# Altium schematic sheet rsx_low_power_board_24V.SchDoc
size A4
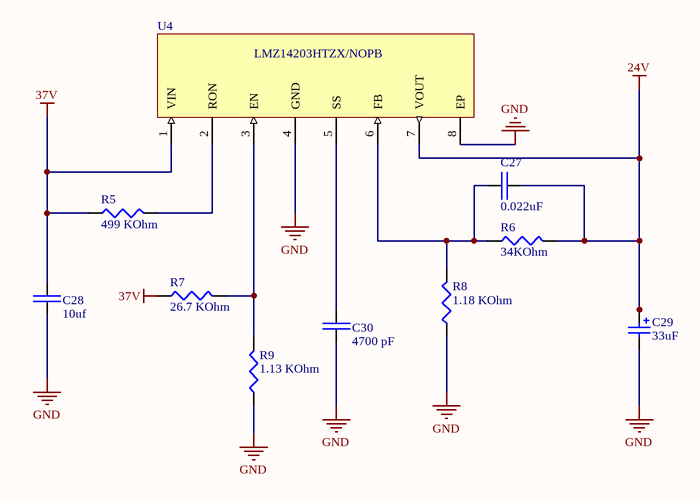
[diagram p0: rsx_low_power_board_24V.SchDoc]

## Parts
C27  0.022uF  [0.022uF Ceramic]
C28  10uf  [10uF capacitor LPB]
C29  33uF  [33uF Through hole Radical]
C30  4700 pF  [4700uF 0805]
R5  499 KOhm  [499KOhm RG2012]
R6  34KOhm  [34 KOhm Resistor ERA-6A]
R7  26.7 KOhm  [34 KOhm Resistor ERA-6A]
R8  1.18 KOhm  [34 KOhm Resistor ERA-6A]
R9  1.13 KOhm  [34 KOhm Resistor ERA-6A]
U4  LMZ14203HTZX/NOPB  [24V DC to DC buck]

## Nets
24V: C27.2 C29.1 R6.2 U4.7(VOUT)
37V: C28.1 R5.1 R7.1 U4.1(VIN)
GND: C28.2 C29.2 C30.1 R8.1 R9.1 U4.4(GND) U4.8(EP)
NetC27_1: C27.1 R6.1 R8.2 U4.6(FB)
NetC30_2: C30.2 U4.5(SS)
NetR5_2: R5.2 U4.2(RON)
NetR7_2: R7.2 R9.2 U4.3(EN)

## Library data of the parts
C27 = 0.022uF C0805C223K5RACTU: KEMET - C0805C223K5RACTU - CAP, MLCC, X7R, 22NF, 50V, 0805; Dielectric Material: Ceramic; Tolerance: 10%; Supplier 1: Digi-Key; Supplier Part Number 1: 399-1163-1-ND; Manufacturer 1: KEMET; Manufacturer Part Number 1: C0805C223K5RACTU; Stock 1: 516153; Pricing 1: 1=0,10000, 10=0,06000, 100=0,02670, 500=0,01906, 1000=0,01497 (USD); RoHS: Yes; Mount: Surface Mount; Case/Package: 0805; Min Operating Temperature: -55°C; Max Operating Temperature: 125°C; Packaging: Tape and Reel; Capacitance: 22nF; Dielectric: X7R; Voltage Rating (DC): 50V; Voltage: 50V; Length: 2mm; Height: 0.78mm; Depth: 1.25mm; Radiation Hardening: No; ComponentLink1URL: https://datasheet.ciiva.com/18193/getdatasheetpartid-385695-18193669.pdf?src-supplier=Verical; ComponentLink1Description: https://datasheet.ciiva.com/18193/getdatasheetpartid-385695-18193669.pdf?src-supplier=Verical
C28 = GRT31CR61H106ME01L: CAP CER 10UF 50V X5R 1206; Manufacturer 1: Murata; Tolerance: 20%; Supplier 1: Digi-Key; Supplier Part Number 1: 490-12457-1-ND; Manufacturer Part Number 1: GRT31CR61H106ME01L; Stock 1: 8159; Pricing 1: 1=0,50000, 10=0,34900, 100=0,20920, 500=0,15690, 1000=0,13249 (USD); RoHS: Yes; Mount: Surface Mount; Case/Package: 1206; Case Code (Metric): 3216; Case Code (Imperial): 1206; Min Operating Temperature: -55°C; Max Operating Temperature: 85°C; Packaging: Tape and Reel; Capacitance: 10uF; Voltage Rating: 50V; Length: 0.126inch; Width: 0.063inch; Thickness: 0.071inch; Ratings: AEC-Q200; ComponentLink1URL: http://search.murata.co.jp/Ceramy/image/img/A01X/G101/ENG/GRT31CR61H106ME01-01.pdf?src-supplier=Digi-Key; ComponentLink1Description: http://search.murata.co.jp/Ceramy/image/img/A01X/G101/ENG/GRT31CR61H106ME01-01.pdf?src-supplier=Digi-Key; Category: Capacitor
C29 = 33uF UFW1H330MDD1TD: CAP ALUM 33UF 20% 50V RADIAL; Manufacturer 1: Nichicon; Ripple Current: 120mA; Life (Hours): 2000Hour; Supplier 1: Digi-Key; Supplier Part Number 1: 493-11010-1-ND; Manufacturer Part Number 1: UFW1H330MDD1TD; Stock 1: 4144; Pricing 1: 1=0,23000, 10=0,16000, 100=0,09070, 500=0,06404, 1000=0,05603 (USD); RoHS: Yes; Mount: Through Hole; Case/Package: Radial; Min Operating Temperature: -40°C; Max Operating Temperature: 85°C; Package Quantity: 1; Packaging: Tape and Reel; Capacitance: 33uF; Tolerance: 20%; Voltage Rating: 50V; Lead Pitch: 0.079inch; Height - Seated (Max): 0.492inch; ComponentLink1URL: http://nichicon-us.com/english/products/pdfs/e-ufw.pdf?src-supplier=Digi-Key; ComponentLink1Description: http://nichicon-us.com/english/products/pdfs/e-ufw.pdf?src-supplier=Digi-Key; ComponentLink2URL: http://nichicon-us.com/english/products/pdfs/e-mi_tape.pdf?src-supplier=Digi-Key; ComponentLink2Description: http://nichicon-us.com/english/products/pdfs/e-mi_tape.pdf?src-supplier=Digi-Key
C30 = 4700pF 0805: KEMET - C0805C472K5RACTU - CERAMIC CAPACITOR 4700PF, 50V, X7R, 10%, 0805; Capacitance: 4.7nF; Supplier 1: Digi-Key; Supplier Part Number 1: 399-1155-1-ND; Manufacturer 1: KEMET; Manufacturer Part Number 1: C0805C472K5RACTU; Stock 1: 374666; Pricing 1: 1=0,10000, 10=0,06800, 100=0,03040, 500=0,02172, 1000=0,01706 (USD); RoHS: Yes; Mount: Surface Mount; Case/Package: 0805; Number of Pins: 2; Weight: 0.000194oz; Dielectric Material: Ceramic; Contact Plating: Tin,Matte; Case Code (Imperial): 0805; Case Code (Metric): 2012; Min Operating Temperature: -55°C; Max Operating Temperature: 125°C; Tolerance: 10%; Packaging: Tape and Reel; Dielectric: X7R; Voltage Rating (DC): 50V; Package Quantity: 1; Voltage Rating: 50V; Termination: SMD/SMT; Voltage: 50V; Length: 2mm; Height: 0.78mm; Depth: 1.25mm; Width: 0.049inch; Thickness: 0.035inch; Radiation Hardening: No; REACH SVHC: No SVHC; ComponentLink1URL: https://datasheet.ciiva.com/6074/kem-c1002-x7r-smd-6074679.pdf?src-supplier=Farnell; ComponentLink1Description: https://datasheet.ciiva.com/6074/kem-c1002-x7r-smd-6074679.pdf?src-supplier=Farnell; ComponentLink2URL: https://datasheet.ciiva.com/28682/1851736-28682318.pdf?src-supplier=Element14; ComponentLink2Description: https://datasheet.ciiva.com/28682/1851736-28682318.pdf?src-supplier=Element14
R5 = RG2012P-4993-B-T5: RES SMD 499K OHM 0.1% 1/8W 0805; Manufacturer 1: Susumu; Resistance: 499kR; Power Rating: 125mW; Voltage Rating: 150V; Temperature Coefficient: 25ppm/°C; Supplier 1: Digi-Key; Supplier Part Number 1: RG20P499KBCT-ND; Manufacturer Part Number 1: RG2012P-4993-B-T5; Stock 1: 27646; Pricing 1: 1=0,41000, 10=0,31800, 100=0,13360, 1000=0,07374, 2500=0,06913 (USD); RoHS: Yes; Case/Package: 0805; Weight: 0.000194oz; Case Code (Imperial): 0805; Case Code (Metric): 2012; Min Operating Temperature: -55°C; Max Operating Temperature: 155°C; Packaging: Tape and Reel; Tolerance: 0.1%; Termination: SMD/SMT; Composition: Thin Film; Voltage Rating (DC): 150V; Length: 2mm; Height: 0.4mm; Width: 1.2mm; Lead Free: Lead Free; ComponentLink1URL: https://datasheet.ciiva.com/5624/rg-rm-rgh-datasheet-5624071.pdf?src-supplier=Mouser; ComponentLink1Description: https://datasheet.ciiva.com/5624/rg-rm-rgh-datasheet-5624071.pdf?src-supplier=Mouser
R6 = ERA6AEB3402V: RES SMD 34K OHM 0.1% 1/8W 0805; Manufacturer 1: Panasonic; Resistance: 34kR; Temperature Coefficient: 25ppm/°C; Max Power Dissipation: 125mW; Voltage Rating: 200V; Voltage Rating (DC): 100V; Supplier 1: Digi-Key; Supplier Part Number 1: P34KDACT-ND; Manufacturer Part Number 1: ERA6AEB3402V; Stock 1: 7057; Pricing 1: 1=0,36000, 10=0,30200, 100=0,11820, 1000=0,04948, 2500=0,04536 (USD); RoHS: Yes; Mount: Surface Mount; Case/Package: 0805; Number of Pins: 2; Case Code (Imperial): 0805; Case Code (Metric): 2012; Contact Plating: Tin; Min Operating Temperature: -55°C; Max Operating Temperature: 155°C; Tolerance: 0.1%; Packaging: Tape and Reel; Composition: Metal Film,Thin Film; Number of Terminations: 2; Features: Automotive AEC-Q200; Power Rating: 125mW; Package Quantity: 5000; Termination: SMD/SMT; Military Standard: Not; Length: 2mm; Height: 0.5mm; Width: 1.25mm; Depth: 1.25mm; Radiation Hardening: No; Lead Free: Lead Free; REACH SVHC: No SVHC; ComponentLink1URL: https://datasheet.ciiva.com/11815/0900766b80eb1d8c-11815791.pdf?src-supplier=RSComponents; ComponentLink1Description: https://datasheet.ciiva.com/11815/0900766b80eb1d8c-11815791.pdf?src-supplier=RSComponents; ComponentLink2URL: https://datasheet.ciiva.com/41450/001181326-da-01-en-widerstand-era-0805-34k0-0-1-5000st-41450489.pdf?src-supplier=Conrad; ComponentLink2Description: https://datasheet.ciiva.com/41450/001181326-da-01-en-widerstand-era-0805-34k0-0-1-5000st-41450489.pdf?src-supplier=Conrad; ComponentLink3URL: https://datasheet.ciiva.com/9190/aoa0000ce26-9190487.pdf?src-supplier=Avnet; ComponentLink3Description: https://datasheet.ciiva.com/9190/aoa0000ce26-9190487.pdf?src-supplier=Avnet; ComponentLink4URL: https://datasheet.ciiva.com/17210/aoa0000ce26-17210191.pdf?src-supplier=Avnet+Europe; ComponentLink4Description: https://datasheet.ciiva.com/17210/aoa0000ce26-17210191.pdf?src-supplier=Avnet+Europe; ComponentLink5URL: https://datasheet.ciiva.com/22705/485442-22705221.pdf?src-supplier=Element14; ComponentLink5Description: https://datasheet.ciiva.com/22705/485442-22705221.pdf?src-supplier=Element14; ComponentLink6URL: https://datasheet.ciiva.com/6052/485442-6052790.pdf?src-supplier=Farnell; ComponentLink6Description: https://datasheet.ciiva.com/6052/485442-6052790.pdf?src-supplier=Farnell; ComponentLink7URL: https://datasheet.ciiva.com/7870/485442-7870667.pdf?src-supplier=Element14; ComponentLink7Description: https://datasheet.ciiva.com/7870/485442-7870667.pdf?src-supplier=Element14; ComponentLink8URL: https://datasheet.ciiva.com/7870/485442-7870668.pdf?src-supplier=Element14; ComponentLink8Description: https://datasheet.ciiva.com/7870/485442-7870668.pdf?src-supplier=Element14
R7-R9 = ERA-6AEB1181V: RES SMD 1.18K OHM 0.1% 1/8W 0805; Manufacturer 1: Panasonic; Resistance: 1.18kR; Power Rating: 125mW; Voltage Rating: 100V; Temperature Coefficient: 25ppm/°C; Supplier 1: Digi-Key; Supplier Part Number 1: P1.18KDACT-ND; Manufacturer Part Number 1: ERA-6AEB1181V; Stock 1: 9011; Pricing 1: 1=0,36000, 10=0,30200, 100=0,11820, 1000=0,04948, 2500=0,04536 (USD); RoHS: Yes; Mount: Surface Mount; Case/Package: 0805; Number of Pins: 2; Case Code (Imperial): 0805; Case Code (Metric): 2012; Contact Plating: Tin; Min Operating Temperature: -55°C; Max Operating Temperature: 155°C; Tolerance: 0.1%; Packaging: Tape and Reel; Composition: Metal Film,Thin Film; Package Quantity: 1; Termination: SMD/SMT; Number of Terminations: 2; Max Power Dissipation: 125mW; Voltage Rating (DC): 100V; Features: Automotive AEC-Q200; Length: 2mm; Height: 0.5mm; Width: 1.25mm; Depth: 1.25mm; Radiation Hardening: No; Lead Free: Lead Free; ComponentLink1URL: https://datasheet.ciiva.com/11811/0900766b80eb1d8c-11811515.pdf?src-supplier=RSComponents; ComponentLink1Description: https://datasheet.ciiva.com/11811/0900766b80eb1d8c-11811515.pdf?src-supplier=RSComponents; ComponentLink2URL: https://datasheet.ciiva.com/26335/459360-da-01-en-widerstand-0805-era-26335818.pdf?src-supplier=Conrad; ComponentLink2Description: https://datasheet.ciiva.com/26335/459360-da-01-en-widerstand-0805-era-26335818.pdf?src-supplier=Conrad; ComponentLink3URL: https://datasheet.ciiva.com/7911/485442-7911589.pdf?src-supplier=Element14; ComponentLink3Description: https://datasheet.ciiva.com/7911/485442-7911589.pdf?src-supplier=Element14; ComponentLink4URL: https://datasheet.ciiva.com/7911/485442-7911590.pdf?src-supplier=Element14; ComponentLink4Description: https://datasheet.ciiva.com/7911/485442-7911590.pdf?src-supplier=Element14; ComponentLink5URL: https://datasheet.ciiva.com/5870/485442-5870600.pdf?src-supplier=Farnell; ComponentLink5Description: https://datasheet.ciiva.com/5870/485442-5870600.pdf?src-supplier=Farnell; ComponentLink6URL: https://datasheet.ciiva.com/5870/485442-5870601.pdf?src-supplier=Farnell; ComponentLink6Description: https://datasheet.ciiva.com/5870/485442-5870601.pdf?src-supplier=Farnell; ComponentLink7URL: https://datasheet.ciiva.com/9198/aoa0000ce26-9198586.pdf?src-supplier=Avnet; ComponentLink7Description: https://datasheet.ciiva.com/9198/aoa0000ce26-9198586.pdf?src-supplier=Avnet; ComponentLink8URL: https://datasheet.ciiva.com/5870/485442-5870603.pdf?src-supplier=Farnell; ComponentLink8Description: https://datasheet.ciiva.com/5870/485442-5870603.pdf?src-supplier=Farnell
U4 = LMZ14203HTZX/NOPB: IC BUCK SYNC ADJ 3A TO-PMOD-7; Manufacturer 1: TI National Semiconductor; Number of Outputs: 1; Output Voltage: 5V; Max Input Voltage: 42V; Min Input Voltage: 6V; Efficiency: 97%; Voltage - Output 1: 30V; Isolation: Non-Isolated; Max Power Dissipation: 90W; Switching Frequency: 1MHz; Supplier 1: Digi-Key; Supplier Part Number 1: 296-43602-1-ND; Manufacturer Part Number 1: LMZ14203HTZX/NOPB; Stock 1: 794; Pricing 1: 1=12,71000, 5=12,61600, 10=12,52000, 25=12,32720, 50=11,94180, 100=10,78620, 250=10,59356 (USD); RoHS: Yes; Mount: Surface Mount; Number of Pins: 7; Contact Plating: Tin,Matte; Min Operating Temperature: -40°C; Max Operating Temperature: 125°C; Output Current: 3A; Packaging: Tape and Reel; Package Quantity: 500; Max Output Current: 3A; Features: UVLO; Length: 0.4inch; Height: 0.18inch; Width: 0.54inch; Depth: 9.85mm; Lead Free: Lead Free; ComponentLink1URL: http://components.arrow.com/part/dataview/56275422S8868331N1317?src-supplier=Arrow; ComponentLink1Description: http://components.arrow.com/part/dataview/56275422S8868331N1317?src-supplier=Arrow; ComponentLink2URL: http://components.arrow.com/part/dataview/0323_03165962?src-supplier=Arrow+Europe; ComponentLink2Description: http://components.arrow.com/part/dataview/0323_03165962?src-supplier=Arrow+Europe; ComponentLink3URL: http://www.ti.com/general/docs/lit/getliterature.tsp?genericPartNumber=LMZ14203H&&fileType=pdf&src-supplier=Avnet; ComponentLink3Description: http://www.ti.com/general/docs/lit/getliterature.tsp?genericPartNumber=LMZ14203H&&fileType=pdf&src-supplier=Avnet; ComponentLink4URL: http://www.ti.com/general/docs/lit/getliterature.tsp?genericPartNumber=LMZ14203H&amp;&amp;fileType=pdf&src-supplier=Avnet+Asia; ComponentLink4Description: http://www.ti.com/general/docs/lit/getliterature.tsp?genericPartNumber=LMZ14203H&amp;&amp;fileType=pdf&src-supplier=Avnet+Asia; ComponentLink5URL: http://www.ti.com/lit/pdf/snaa214?src-supplier=Digi-Key; ComponentLink5Description: http://www.ti.com/lit/pdf/snaa214?src-supplier=Digi-Key; ComponentLink6URL: http://www.ti.com/lit/ds/symlink/lmz14203h.pdf?src-supplier=Digi-Key; ComponentLink6Description: http://www.ti.com/lit/ds/symlink/lmz14203h.pdf?src-supplier=Digi-Key; ComponentLink7URL: http://www.ti.com/lit/gpn/lmz14203h?src-supplier=Mouser; ComponentLink7Description: http://www.ti.com/lit/gpn/lmz14203h?src-supplier=Mouser